# EAGLE design clapper_6 (EAGLE 9.6.2)
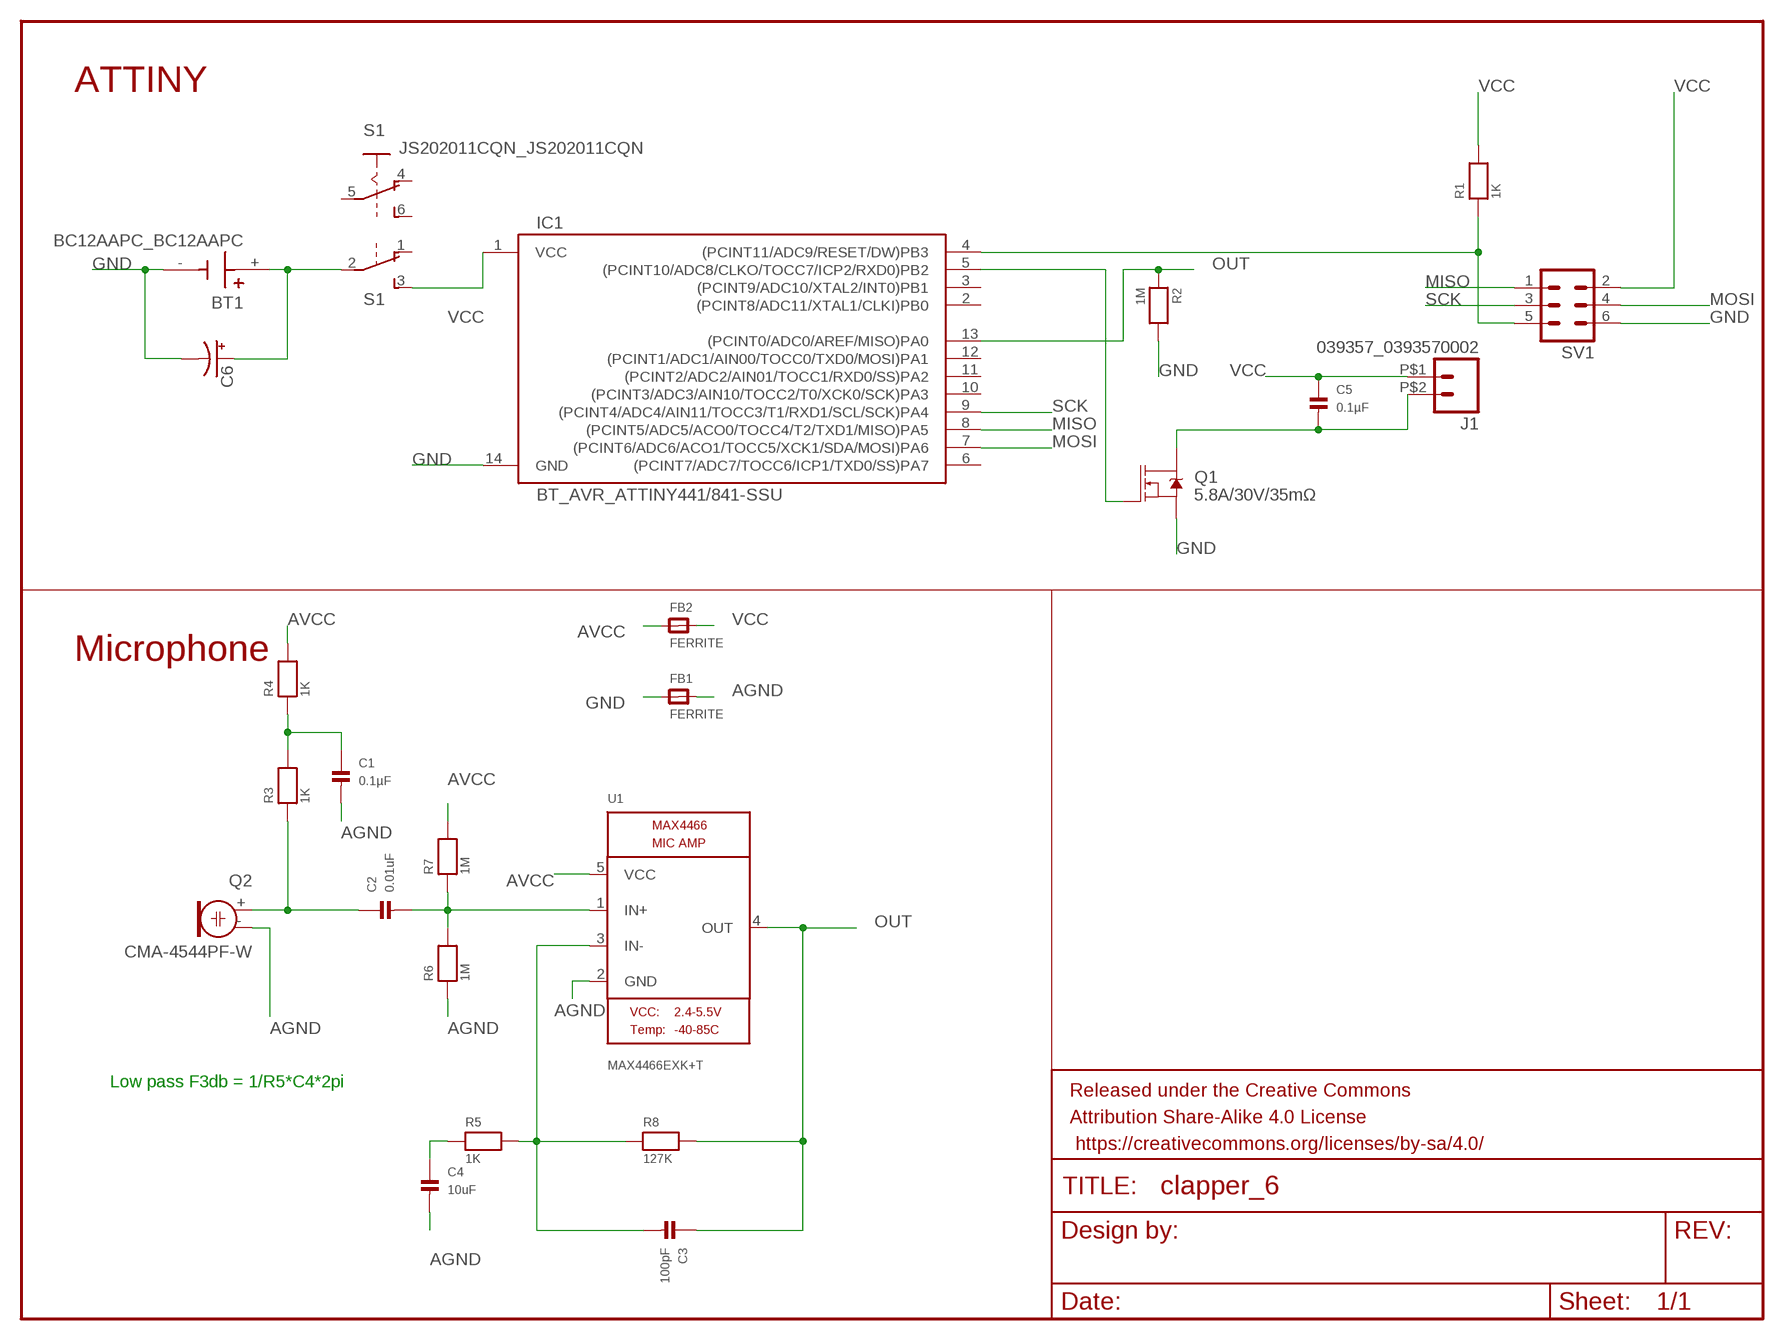
[diagram p0: schematic, sheet 1]

## Parts
BT1  BC12AAPC_BC12AAPC  [BC12AAPC_BAT_BC12AAPC]
C1  0.1µF  MICROBUILDER_CAP_CERAMIC0805  [MICROBUILDER_0805]
C2  0.01uF  MICROBUILDER_CAP_CERAMIC0805  [MICROBUILDER_0805]
C3  100pF  MICROBUILDER_CAP_CERAMIC0805  [MICROBUILDER_0805]
C4  10uF  MICROBUILDER_CAP_CERAMIC0805  [MICROBUILDER_0805]
C5  0.1µF  MICROBUILDER_CAP_CERAMIC0805  [MICROBUILDER_0805]
C6  CPOL-USE2.5-6  [E2,5-6]
FB1  FERRITE  MICROBUILDER_FERRITE0805  [MICROBUILDER_0805]
FB2  FERRITE  MICROBUILDER_FERRITE0805  [MICROBUILDER_0805]
FRAME2  FRAME-LETTER  [CREATIVE_COMMONS]
IC1  BT_AVR_ATTINY441/841-SSU  [BT_AVR_SOIC14N]
J1  039357_0393570002  [039357_0393570002]
Q1  5.8A/30V/35mΩ  MOSFET-NCH-AO3404A  [SOT23-3]
Q2  CMA-4544PF-W  MICROBUILDER_ELECTRET  [MICROBUILDER_ELECTRET_9.7]
R1  1K  MICROBUILDER_RESISTOR0805  [MICROBUILDER_0805]
R2  1M  MICROBUILDER_RESISTOR0805  [MICROBUILDER_0805]
R3  1K  MICROBUILDER_RESISTOR0805  [MICROBUILDER_0805]
R4  1K  MICROBUILDER_RESISTOR0805  [MICROBUILDER_0805]
R5  1K  MICROBUILDER_RESISTOR0805  [MICROBUILDER_0805]
R6  1M  MICROBUILDER_RESISTOR0805  [MICROBUILDER_0805]
R7  1M  MICROBUILDER_RESISTOR0805  [MICROBUILDER_0805]
R8  127K  MICROBUILDER_RESISTOR0805  [MICROBUILDER_0805]
S1  JS202011CQN_JS202011CQN  [JS202011CQN_JS202011CQN]
SV1  CWT_MA03-2  [CWT_MA03-2]
U1  MAX4466EXK+T  MICROBUILDER_MAX4466""  [MICROBUILDER_SC70-5]

## Nets
AGND: C1.2 C4.2 FB1.2 Q2.- R6.1 U1.2(GND)
AVCC: FB2.1 R4.2 R7.2 U1.5(VCC)
GND: BT1.- C6.- FB1.1 IC1.14(GND) Q1.2(S) R2.2 SV1.6
MISO: IC1.8((PCINT5/ADC5/ACO0/TOCC4/T2/TXD1/MISO)PA5) SV1.1
MOSI: IC1.7((PCINT6/ADC6/ACO1/TOCC5/XCK1/SDA/MOSI)PA6) SV1.4
N$1: C5.2 J1.P$2 Q1.3(D)
N$2: BT1.+ C6.+ S1.2(B:P)
N$4: IC1.4((PCINT11/ADC9/RESET/DW)PB3) R1.1 SV1.5
N$5: IC1.5((PCINT10/ADC8/CLKO/TOCC7/ICP2/RXD0)PB2) Q1.1(G)
N$9: C2.1 Q2.+ R3.1
N$10: C1.1 R3.2 R4.1
N$11: C2.2 R6.2 R7.1 U1.1(IN+)
N$12: C3.2 R5.2 R8.1 U1.3(IN-)
N$13: C4.1 R5.1
OUT: C3.1 IC1.13((PCINT0/ADC0/AREF/MISO)PA0) R2.1 R8.2 U1.4(OUT)
SCK: IC1.9((PCINT4/ADC4/AIN11/TOCC3/T1/RXD1/SCL/SCK)PA4) SV1.3
VCC: C5.1 FB2.2 IC1.1(VCC) J1.P$1 R1.2 S1.3(B:S) SV1.2
Unconnected: IC1.2((PCINT8/ADC11/XTAL1/CLKI)PB0) IC1.3((PCINT9/ADC10/XTAL2/INT0)PB1) IC1.6((PCINT7/ADC7/TOCC6/ICP1/TXD0/SS)PA7) IC1.10((PCINT3/ADC3/AIN10/TOCC2/T0/XCK0/SCK)PA3) IC1.11((PCINT2/ADC2/AIN01/TOCC1/RXD0/SS)PA2) IC1.12((PCINT1/ADC1/AIN00/TOCC0/TXD0/MOSI)PA1) S1.1(B:O) S1.4(A:O) S1.5(A:P) S1.6(A:S)

## Notes on the sheet
- ATTINY
- Microphone
- Low pass F3db = 1/R5*C4*2pi

## Library data of the parts
BT1 = cwt_clapper:BC12AAPC_BC12AAPC: Ic Reg Ldo Adj 0.25a 12dfn; AVAILABILITY: Unavailable; DESCRIPTION: Ic Reg Ldo Adj 0.25a 12dfn; MF: MPD _Memory; MP: BC12AAPC; PACKAGE: DFN-12 MPD; PRICE: None
C1-C5 = cwt_clapper:MICROBUILDER_CAP_CERAMIC: Ceramic Capacitors 0402 - 0402 Surface Mount Capacitors 16pF 50V 5% [Digikey: 445-4899-2-ND] 18pF 50V 5% [Digikey: 490-1281-2-ND] 22pF 50V 5% [Digikey: 490-1283-2-ND] 68pF 50V 5% [Digikey: 490-1289-2-ND] 0.1uF 10V 10% [Digikey: 490-1318-2-ND] 1.0uF 6.3V 10% [Digikey: 490-1320-2-ND] 0603 - 0603 Surface Mount Capacitors 16 pF 50V 5% [Digikey: 445-5051-2-ND] 22 pF 50V [Digikey: PCC220ACVTR-ND] 33 pF 50V 5% [Digikey: 490-1415-1-ND] 56pF 50V 5% [Digikey: 490-1421-1-ND] 220pF 50V 5% [Digikey: 445-1285-1-ND] 680 pF 50V 2200 pF 50V 5% C0G [Digikey: 445-1297-1-ND] 5600 pF 100V 5% X7R [Digikey: 478-3711-1-ND] 0.1 µF 25V 10% [Digikey: PCC2277TR-ND] 0.22 µF 16V 10% X7R [Digikey: 445-1318-1-ND] 1.0 µF 25V 10% [Digikey: 445-5146-2-ND] 0603 - RF Specific 3pF 250V +/-0.1pF RF [Digikey: 712-1347-1-ND] 18 pF 250V 5% [Digikey: 478-3505-1-ND or 712-1322-1-ND] 56 pF 250V 5% C0G RF [Digikey: 490-4867-1-ND] 68 pF 250V RF [Digikey: 490-4868-1-ND] 0805 - 0805 Surface Mount Capacitors 220 pF 250V 2% RF Ceramic Capacitor [Digikey: 712-1398-1-ND] 1000 pF 50V 2% NP0 Ceramic Capacitor [Digikey: 478-3760-1-ND] 0.1 µF 25V 10% Ceramic Capacitor [Digikey: PCC1828TR-ND] 1.0 µF 16V 10% Ceramic Capacitor[Digikey: 490-1691-2-ND] 10.0 µF 10V 10% Ceramic Capacitor[Digikey: 709-1228-1-ND] 10.0 uF 16V 10% Ceramic Capacitor [Digikey: 478-5165-2-ND] 47 uF 6.3V 20% Ceramic Capacitor [Digikey: 587-1779-1-ND or 399-5506-1-ND] 1206 - 1206 Surface Mount Capacitors 47uF 10V 20% Ceramic Capacitor [Digikey: 490-5528-1-ND or 399-5508-1-ND or 445-6010-1-ND] 100uF 6.3V -20%, +80% Y5V Ceramic Capacitor (Digikey: 490-4512-1-ND, Mouser: 81-GRM31CF50J107ZE1L)
C6 = cwt_clapper:CPOL-US: POLARIZED CAPACITOR, American symbol
FB1 FB2 = cwt_clapper:MICROBUILDER_FERRITE: Ferrite Bead 0603 MMZ1608B121C - 120 Ohm @ 100MHz, 600mA, 0.15 Ohm DC Resistance - Digikey: 445-2164-1-ND BK1608HW121-T - 120 Ohm, 600mA Ferrite Chip - Digikey: 587-1876-2-ND 0805 HZ0805B272R-10 - 2.7K Ohm @ 100MHz, 200mA, 0.8 Ohm DC Resistance - Digikey: 240-2504-1-ND (see also Murata BLM21BD272SN1L) MMZ2012Y152B - 1.5K Ohm @ 100MHz, 500mA, 0.4 Ohm DC Resistance - Digikey: 445-1560-1-ND - Mainly for high frequency (80-400MHz) MMZ2012R102A - 1K Ohm @ 100MHz, 500mA, 0.3 Ohm DC Resistance - Digikey: 445-1555-2-ND - More general purpose (10-200MHz)
FRAME2 = SparkFun-Aesthetics:FRAME-LETTER: Schematic Frame - Letter Standard 8.5x11 US Letter frame
IC1 = cwt_clapper:BT_AVR_ATTINY441/841: ATtiny441, ATtiny841 AVR Microcontroller The high-performance Atmel picoPower 8-bit AVR RISC-based microcontroller combines 4KB ISP flash memory, 512-Byte EEPROM, 128B SRAM, 12 general purpose I/O lines, 32 general purpose working registers, an 8-bit timer/counter with two PWM channels, two 16-bit timer/counters with two PWM channels, internal and external interrupts, an 12-channel 10-bit A/D converter, 2 On-chip analog comparators, 2 full duplex USARTs with Start Frame wake up from power down, master/slave SPI serial interface, slave I2C serial interface, programmable gain stage (1x, 20x, and 100x) for 12 differential ADC channel pairs, programmable watchdog timer with internal oscillator, internal calibrated oscillator, and four software selectable power saving modes. The device operates between 1.7-5.5 volts. datasheet.pdf <http://www.atmel.com/Images/Atmel-8495-8-bit-AVR-Microcontrollers-ATtiny441-ATtiny841_Datasheet.pdf>
J1 = cwt_clapper:039357_0393570002
Q1 = cwt_clapper:MOSFET-NCH: N-channel MOSFETs Voltage controlled devices that allow control of high current outputs. SparkFun Products: SparkFun OpenScale <https://www.sparkfun.com/products/13261> SparkFun Digital Sandbox <https://www.sparkfun.com/products/12651> SparkFun Monster Moto Shield <https://www.sparkfun.com/products/10182> SparkFun MOSFET Power Controller <https://www.sparkfun.com/products/11214>; PROD_ID: TRANS-12988
Q2 = cwt_clapper:MICROBUILDER_ELECTRET: Electret microphone Thru hole 2.54mm spacing with 9.7mm diameter
R1-R8 = cwt_clapper:MICROBUILDER_RESISTOR: Resistors 0402 - 0402 Surface Mount Package 22 Ohm 1% 1/16W [Digikey: 311-22.0LRTR-ND] 33 Ohm 5% 1/16W 1.0K 5% 1/16W 1.5K 5% 1/16W 2.0K 1% 1/16W 10.0K 1% 1/16W [Digikey: 311-10.0KLRTR-ND] 10.0K 5% 1/16W [Digikey: RMCF0402JT10K0TR-ND] 12.1K 1% 1/16W [Digikey: 311-22.0LRTR-ND] 100.0K 5% 1/16W 0603 - 0603 Surface Mount Package 0 Ohm 1/10 Watt 1% Resistor 15 Ohm 1/10 Watt 1% Resistor 33 Ohm 1/10 Watt 1% Resistor 49.9 Ohm 1/10 Watt 1% Resistor 100 Ohm 1/10 Watt 1% Resistor 150 Ohm 1/10 Watt 1% Resistor 240 Ohm 1/10 Watt 1% Resistor 390 Ohm 1/10 Watt 1% Resistor 560 Ohm 1/10 Watt 1% Resistor 680 Ohm 1/10 Watt 1% Resistor 750 Ohm 1/10 Watt 1% Resistor 1.0K Ohm 1/10 Watt 1% Resistor 1.5K Ohm 1/10 Watt 1% Resistor 2.0K Ohm 1/10 Watt 1% Resistor 2.2K Ohm 1/10 Watt 1% Resistor 3.3K Ohm 1/10 Watt 1% Resistor 4.7K Ohm 1/10 Watt 1% Resistor 10.0K Ohm 1/10 Watt 1% Resistor 12.0K Ohm 1/10 Watt 1% Resistor 12.1K Ohm 1/10 Watt 1% Resistor 20.0K Ohm 1/10 Watt 1% Resistor 33.0K Ohm 1/10 Watt 1% Resistor 100.0K Ohm 1/10 Watt 1% Resistor 0805 - 0805 Surface Mount Package 0 Ohm 1/8 Watt 1% Resistor 33 Ohm 1/8 Watt 1% Resistor 100 Ohm 1/8 Watt 1% Resistor 150 Ohm 1/8 Watt 1% Resistor 200 Ohm 1/8 Watt 1% Resistor 240 Ohm 1/8 Watt 1% Resistor 330 Ohm 1/8 Watt 1% Resistor 390 Ohm 1/8 Watt 1% Resistor 470 Ohm 1/8 Watt 1% Resistor 1.0K Ohm 1/8 Watt 1% Resistor 1.5K Ohm 1/8 Watt 1% Resistor 2.0K Ohm 1/8 Watt 1% Resistor 4.7K Ohm 1/8 Watt 1% Resistor 5.1K Ohm 1/8 Watt 1% Resistor 5.6K Ohm 1/8 Watt 1% Resistor 10.0K Ohm 1/8 Watt 1% Resistor 22.0K Ohm 1/8 Watt 1% Resistor 33.0K Ohm 1/8 Watt 1% Resistor 100K Ohm 1/8 Watt 1% Resistor 1206 - 1206 Surface Mount Package 2012 - 2010 Surface Mount Package 0.11 Ohm 1/2 Watt 1% Resistor - Digikey: RHM.11UCT-ND
S1 = cwt_clapper:JS202011CQN_JS202011CQN: SLIDING SWITCH Siemens, distributor Buerklin, 11G766 Check prices <https://pricing.snapeda.com/parts/JS202011CQN/CK/view-part?ref=eda>; AVAILABILITY: Warning; DESCRIPTION: Switch Slide ON ON DPDT Top Slide 0.3A 6VDC PC Pins Thru-Hole Bulk; MF: CK; MP: JS202011CQN; PACKAGE: None; PRICE: None; PURCHASE-URL: https://pricing.snapeda.com/search/part/JS202011CQN/?ref=eda
SV1 = cwt_clapper:CWT_MA03-2: PIN HEADER; OC_FARNELL: unknown; OC_NEWARK: unknown
U1 = cwt_clapper:MICROBUILDER_MAX4466: MAX4466 - Microphone Pre-Amp

## Board
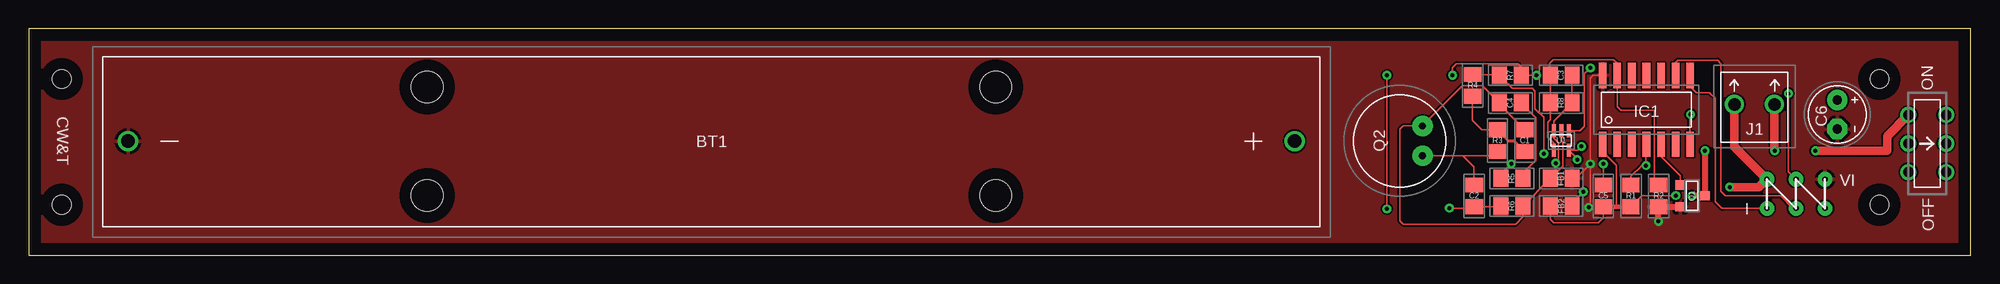
[diagram p1: board, top side]
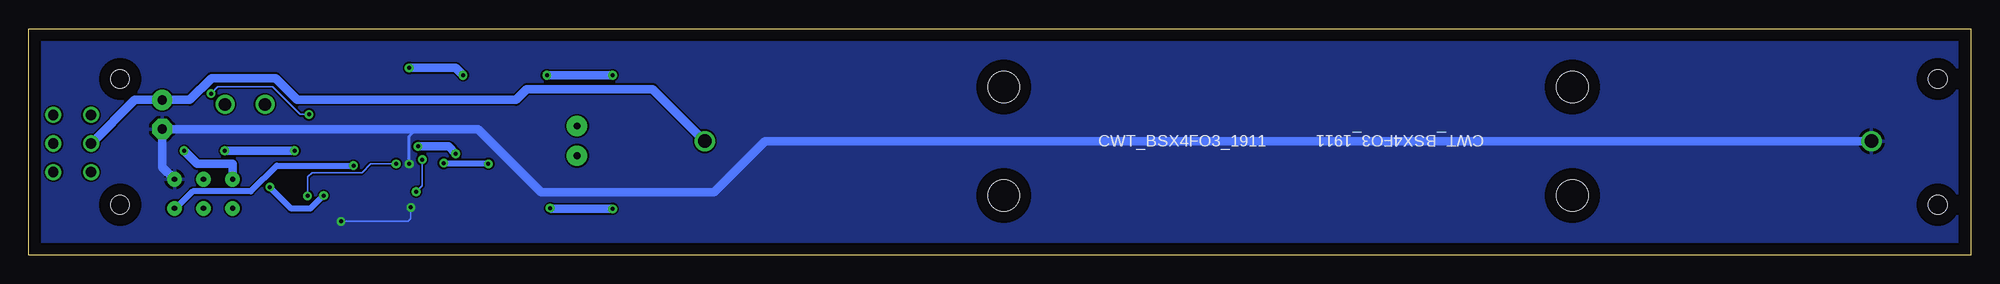
[diagram p2: board, bottom side, seen from below]

Size 169.8 x 19.8 mm. Coordinates in mm from the lower left corner, seen from the top.
Outline: 169.8,0 169.8,19.8 0,19.8 0,0 169.8,0
Copper layers (1*16): Top 0.035mm / dielectric 1.5mm / Bottom 0.035mm
Design rules "default": minimum track width 6mil, minimum drill 0.35mm, track to track 6mil, track to pad 6mil, pad to pad 6mil, via to via 6mil, smd to smd 6mil, copper to edge 40mil, drill to drill 6mil, minimum pad ring 10mil, minimum via ring 8mil, stop-mask expansion 4mil, vias tented up to drill 0mil, thermal gap 10mil
Holes 1.62 mm at 2.9,15.4 161.8,15.4 161.8,4.4 2.9,4.4

### Footprints (pad centres in the part's own frame; a part is rotated, then mirrored left to right if it is on the bottom)
BC12AAPC_BAT_BC12AAPC = drill 1.18: + -51,0; - 51,0 | hole 2.75: -24.85,4.75; -24.85,-4.75; 24.85,4.75; 24.85,-4.75
MICROBUILDER_0805 = smd 1.3 x 1.5: 1 -0.95,0; 2 0.95,0
E2,5-6 = drill 0.813 pad 1.778: + -1.27,0 | drill 0.813 pad 1.778 octagon: - 1.27,0
BT_AVR_SOIC14N = smd 0.66 x 2.2: 1 -3.81,-3; 2 -2.54,-3; 3 -1.27,-3; 4 0,-3; 5 1.27,-3; 6 2.54,-3; 7 3.81,-3; 8 3.81,3; 9 2.54,3; 10 1.27,3; 11 0,3; 12 -1.27,3; 13 -2.54,3; 14 -3.81,3
039357_0393570002 = drill 1.1: P$1 -1.75,0; P$2 1.75,0
SOT23-3 = smd 0.8 x 0.9: 1 -0.95,-1; 2 0.95,-1; 3 0,1.1
MICROBUILDER_ELECTRET_9.7 = drill 0.6 pad 1.778: + -1.3,-2; - 1.3,-2
JS202011CQN_JS202011CQN = drill 0.9: 1 -2.5,1.65; 2 0,1.65; 3 2.5,1.65; 4 -2.5,-1.65; 5 0,-1.65; 6 2.5,-1.65
CWT_MA03-2 = drill 0.457 pad 1.27: 1 -2.54,-1.27; 2 -2.54,1.27; 3 0,-1.27; 4 0,1.27; 5 2.54,-1.27; 6 2.54,1.27
MICROBUILDER_SC70-5 = smd 0.35 x 1.15: 1 -0.65,-0.85; 2 0,-0.85; 3 0.65,-0.85; 4 0.65,0.85; 5 -0.65,0.85

### Placement (x,y rotation side)
BT1  59.69,9.96 180 top
C1  130.81,10.01 90 top
C2  126.36,5.18 270 top
C3  133.99,15.72 0 top
C4  129.54,13.31 180 top
C5  137.67,5.18 90 top
C6  158.12,12.29 270 top
FB1  133.99,6.71 180 top
FB2  133.99,4.29 180 top
FRAME2  21,-6.5 0 top  (outside the outline)
IC1  141.43,12.71 0 top
J1  150.88,13.18 0 top
Q1  145.41,5.18 270 top
Q2  119.86,9.99 90 top
R1  140.08,5.18 270 top
R2  142.49,5.18 270 top
R3  128.4,10.01 90 top
R4  126.24,14.84 90 top
R5  129.67,6.71 180 top
R6  129.67,4.29 180 top
R7  129.54,15.72 180 top
R8  133.99,13.31 180 top
S1  165.99,9.76 90 top
SV1  154.51,5.36 0 top
U1  133.99,10.01 180 top

### Tracks (layer width: path | path; a pad name or v marks a point on that pad's centre or on a via)
AGND
  Top 0.152: C4.2 128.2,13.7 | 128.2,13.7 127.27,14.63 127.27,14.65 127.1,14.81 125.33,14.81 122.14,11.63 Q2.- 120.17,11.31 119.89,11.03 119.89,3.02 120.19,2.72 130,2.72 130.62,3.34 R6.1 FB1.2 134.11,7.78 134.11,9.89 133.99,10.01 U1.2 | C1.2 128.2,13.57 128.2,13.7
AVCC  (via drill 0.35)
  Top 0.152: v135.38,8.36 135.38,8.41 U1.5 135.42,9.16 v135.76,9.5 | v132.46,8.87 132.46,12.04 131.7,12.8 131.7,14.33 131.44,14.58 129.73,14.58 R7.2 128.53,15.79 R4.2 | v135.92,5.54 134.94,4.56 FB2.1
  Bottom 0.152: v135.38,8.36 135.38,6.08 v135.92,5.54
  Bottom 0.762: v135.76,9.5 133.1,9.5 v132.46,8.87
GND  (via drill 0.35)
  Top 0.152: FB1.1 135.25,6.71 v136.53,7.98 | IC1.14 136.76,15.71 136.53,15.47 v136.53,7.98 | v136.53,7.98 136.53,4.3 v136.39,4.17
  Top 0.508: Q1.2 R2.2 v142.49,2.95
  Bottom 0.152: v136.39,4.17 136.39,3.16 136.6,2.95 v142.49,2.95
  Bottom 0.254: v136.53,7.98 136.53,10.39 135.89,11.03
  Bottom 0.762: BT1.- 105.42,9.96 109.87,5.51 124.97,5.51 130.49,11.03 135.89,11.03 C6.- 158.12,7.7 SV1.6
  pour Top: -5,21.5 175,21.5 175,-3.5 -5,-3.5
  pour Bottom: 178,25.5 -2,25.5 -2,-0.5 178,-0.5
MISO
  Top 0.152: SV1.1 148.03,4.09 147.45,4.67 147.45,13.69 146.94,14.2 145.8,14.2 145.24,14.76 IC1.8
MOSI  (via drill 0.35 pad 0.55)
  Top 0.152: IC1.7 145.24,12.24 v145.29,12.29 | v153.85,14.13 153.85,7.29 SV1.4
  Bottom 0.152: v145.29,12.29 146.05,12.29 148.46,14.71 153.27,14.71 v153.85,14.13
N$1  (via drill 0.35, 0.35 pad 0.55)
  Top 0.152: 146.56,5.23 Q1.3 | v137.67,7.98 C5.2
  Top 0.508: v146.56,9.12 146.56,5.23 | Q1.3 v145.41,5.18
  Top 0.762: J1.P$2 152.63,9.15 v152.65,9.12
  Bottom 0.152: v145.41,5.18 145.41,6.83 145.03,7.22 140.64,7.22 139.89,7.98 v137.67,7.98
  Bottom 0.762: v152.65,9.12 v146.56,9.12
N$2
  Bottom 0.762: BT1.+ 115.24,14.51 126.24,14.51 127.19,13.56 146.3,13.56 148.21,15.47 153.8,15.47 155.7,13.56 C6.+ 160.53,13.56 S1.2
N$4  (via drill 0.35 pad 0.55)
  Top 0.152: R1.1 140.08,6.89 141.01,7.83 v141.4,7.83 141.4,9.68 IC1.4
  Bottom 0.152: SV1.5 156.92,4.09
  Bottom 0.508: v141.4,7.83 148.1,7.83 150.37,5.56 155.45,5.56 156.92,4.09
N$5
  Top 0.152: IC1.5 142.7,8.66 144.41,6.95 Q1.1
N$9
  Top 0.152: Q2.+ 125.38,8.71 | 125.38,8.71 126.36,7.72 C2.1 | 128.05,8.71 125.38,8.71
  Top 0.254: R3.1 128.05,8.71
N$10
  Top 0.152: R4.1 126.24,11.79 127.07,10.96 R3.2
  Top 0.254: R3.2 129.35,10.01 129.86,10.01 C1.1
N$11  (via drill 0.35)
  Top 0.152: U1.1 135.6,10.86 136.02,11.28 136.02,15.85 v136.53,16.36 | v118.75,15.72 v118.75,4.04 | v124.21,4.11 126.24,4.11 C2.2 128.66,4.23 | v124.49,15.72 124.49,16.39 124.84,16.74 130.18,16.74 130.56,16.36 130.56,15.79 R7.1 v131.83,15.72
  Top 0.381: 128.66,4.23 R6.2
  Bottom 0.762: v136.53,16.36 132.46,16.36 v131.83,15.72 | v124.49,15.72 v118.75,15.72 | v124.21,4.11 124.14,4.04 v118.75,4.04
N$12  (via drill 0.35)
  Top 0.152: C3.2 R8.1 133.34,11.71 U1.3 133.35,10.84 133.35,10.22 133.74,9.83 133.74,8.23 133.56,8.05 v133.5,8.05 | v129.61,7.98 128.72,7.09 R5.2
  Bottom 0.508: v133.5,8.05 129.68,8.05 v129.61,7.98
N$13
  Top 0.152: R5.1 130.62,7.14 131.79,8.31 131.79,12.01 C4.1
OUT
  Top 0.152: C3.1 133.03,15.47 | 133.03,15.47 R8.2 133.03,11.84 132.8,11.61 132.8,10.32 133.34,9.79 U1.4 | 133.03,15.47 132.97,15.54 132.97,16.74 133.31,17.08 138.56,17.08 138.89,16.75 IC1.13 138.89,12.98 139.19,12.68 142.11,12.68 142.11,6.51 R2.1
SCK
  Top 0.152: IC1.9 143.97,16.82 144.19,17.04 147.66,17.04 147.96,16.74 147.96,5.56 148.34,5.18 153.16,5.18 154.25,4.09 SV1.3
VCC  (via drill 0.35)
  Top 0.152: FB2.2 133.03,3.15 133.35,2.83 137.22,2.83 137.67,3.28 C5.1 | 138.81,4.23 138.81,7.85 137.62,9.04 IC1.1 | R1.2 141.05,5.2 v144,5.2
  Top 0.381: C5.1 138.81,4.23 R1.2
  Top 0.762: J1.P$1 149.13,9.48 SV1.2 151.28,5.95 v148.72,5.95 | v156.21,9.12 162.47,9.12 162.47,10.39 S1.3
  Bottom 0.508: v144,5.2 144.03,5.2 145.16,4.07 146.84,4.07 v148.72,5.95
  Bottom 0.762: v156.21,9.12 155.07,7.98 151.97,7.98 SV1.2

### Text on the board
tPlace: ON | CW&T | VI | I | OFF
bPlace: CWT_BSX4FO3_1911 | CWT_BSX4FO3_1911